# EAGLE design main_board (EAGLE 7.4.0)
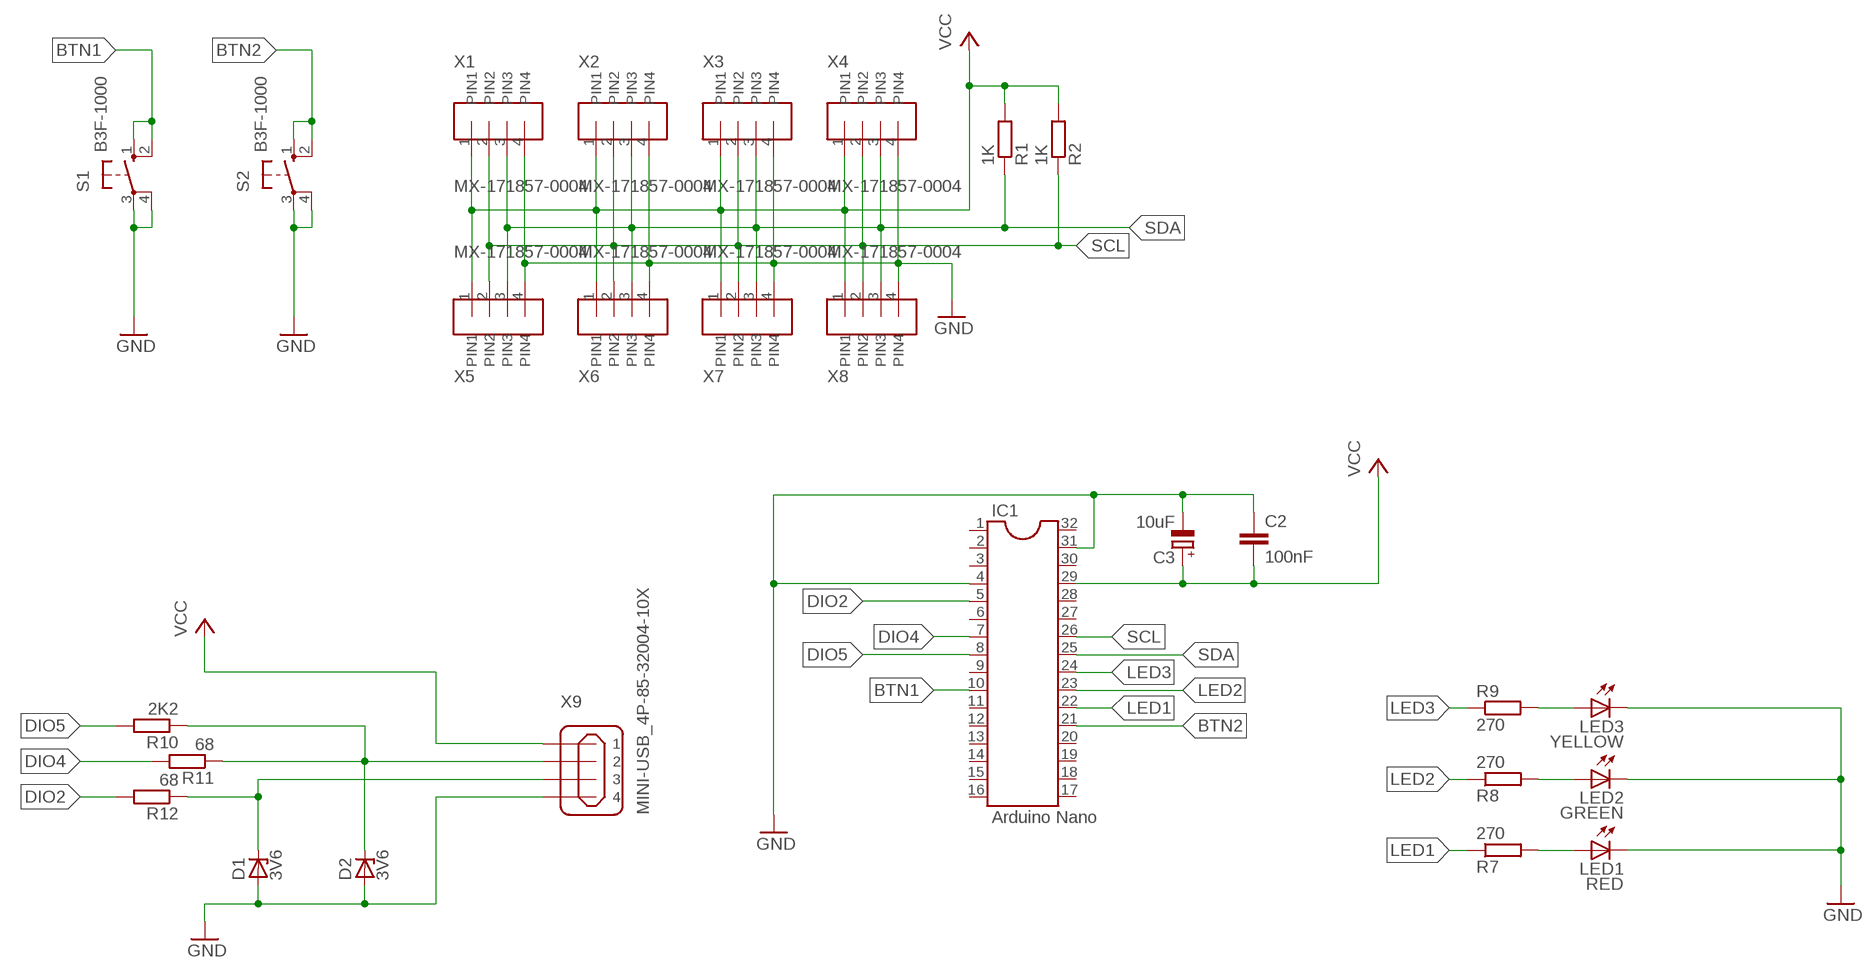
[diagram p0: schematic, sheet 1]

## Parts
C2  100nF  C-EU050-030X075  [C050-030X075]
C3  10uF  CPOL-EUE2.5-7  [E2,5-7]
D1  3V6  ZPD  [DO35Z10]
D2  3V6  ZPD  [DO35Z10]
IC1  Arduino Nano  DIL32  [DIL32]
LED1  RED  TLLR4400  [LED3MM]
LED2  GREEN  TLLR4400  [LED3MM]
LED3  YELLOW  TLLR4400  [LED3MM]
R1  1K  R-EU_0204/7  [0204/7]
R2  1K  R-EU_0204/7  [0204/7]
R7  270  R-EU_0204/7  [0204/7]
R8  270  R-EU_0204/7  [0204/7]
R9  270  R-EU_0204/7  [0204/7]
R10  2K2  R-EU_0204/7  [0204/7]
R11  68  R-EU_0204/7  [0204/7]
R12  68  R-EU_0204/7  [0204/7]
S1  B3F-1000  10-XX  [B3F-10XX]
S2  B3F-1000  10-XX  [B3F-10XX]
X1  MX-171857-0004  [MX-171857-0004]
X2  MX-171857-0004  [MX-171857-0004]
X3  MX-171857-0004  [MX-171857-0004]
X4  MX-171857-0004  [MX-171857-0004]
X5  MX-171857-0004  [MX-171857-0004]
X6  MX-171857-0004  [MX-171857-0004]
X7  MX-171857-0004  [MX-171857-0004]
X8  MX-171857-0004  [MX-171857-0004]
X9  MINI-USB_4P-85-32004-10X  [85-32004-10X]

## Nets
BTN1: IC1.10 S1.1(S) S1.2(S1)
BTN2: IC1.21 S2.1(S) S2.2(S1)
DIO2: IC1.5 R12.2
DIO4: IC1.7 R11.2
DIO5: IC1.8 R10.2
GND: C2.1 C3.- D1.A D2.A IC1.4 IC1.31 LED1.K(C) LED2.K(C) LED3.K(C) S1.3(P) S1.4(P1) S2.3(P) S2.4(P1) X1.4(PIN4) X2.4(PIN4) X3.4(PIN4) X4.4(PIN4) X5.4(PIN4) X6.4(PIN4) X7.4(PIN4) X8.4(PIN4) X9.4
LED1: IC1.22 R7.1
LED2: IC1.23 R8.1
LED3: IC1.24 R9.1
N$4: LED3.A R9.2
N$5: D1.C R12.1 X9.3
N$6: D2.C R10.1 R11.1 X9.2
N$7: LED2.A R8.2
N$8: LED1.A R7.2
SCL: IC1.26 R2.1 X1.2(PIN2) X2.2(PIN2) X3.2(PIN2) X4.2(PIN2) X5.2(PIN2) X6.2(PIN2) X7.2(PIN2) X8.2(PIN2)
SDA: IC1.25 R1.1 X1.3(PIN3) X2.3(PIN3) X3.3(PIN3) X4.3(PIN3) X5.3(PIN3) X6.3(PIN3) X7.3(PIN3) X8.3(PIN3)
VCC: C2.2 C3.+ IC1.29 R1.2 R2.2 X1.1(PIN1) X2.1(PIN1) X3.1(PIN1) X4.1(PIN1) X5.1(PIN1) X6.1(PIN1) X7.1(PIN1) X8.1(PIN1) X9.1
Unconnected: IC1.1 IC1.2 IC1.3 IC1.6 IC1.9 IC1.11 IC1.12 IC1.13 IC1.14 IC1.15 IC1.16 IC1.17 IC1.18 IC1.19 IC1.20 IC1.27 IC1.28 IC1.30 IC1.32

## Library data of the parts
C2 = resistor:C-EU: CAPACITOR, European symbol; TME_CODE: CC-100N
C3 = rcl:CPOL-EU: POLARIZED CAPACITOR, European symbol; TME_CODE: UPW2A100MED
D1 D2 = diode:ZPD: Z DIODE 500 mW; TME_CODE: ZPD3.6-DIO
IC1 = ic-package:DIL32: Dual In Line; DX_CODE: 844081877; TME_CODE: N/A
LED1 = led:TLLR4400: Low Current (2mA) LED 3 mm Tinted Diffused Package color RED Source: Data sheet <http://www.farnell.com/datasheets/391100.pdf>; MF: VISHAY SEMICONDUCTOR; OC_FARNELL: 1612437; TME_CODE: L-934ID
LED2 = led:TLLR4400: Low Current (2mA) LED 3 mm Tinted Diffused Package color RED Source: Data sheet <http://www.farnell.com/datasheets/391100.pdf>; MF: VISHAY SEMICONDUCTOR; OC_FARNELL: 1612437; TME_CODE: L-934GD
LED3 = led:TLLR4400: Low Current (2mA) LED 3 mm Tinted Diffused Package color RED Source: Data sheet <http://www.farnell.com/datasheets/391100.pdf>; MF: VISHAY SEMICONDUCTOR; OC_FARNELL: 1612437; TME_CODE: L-934YD
R1 R2 = resistor:R-EU_: RESISTOR, European symbol; TME_CODE: CF1/4W-1K
R7-R9 = resistor:R-EU_: RESISTOR, European symbol; TME_CODE: CF1/2WS-270R
R10 = resistor:R-EU_: RESISTOR, European symbol; TME_CODE: 1/4W2.2K
R11 R12 = resistor:R-EU_: RESISTOR, European symbol; TME_CODE: CF1/2WS-68R
S1 S2 = switch-omron:10-XX: OMRON SWITCH; MPN: B3F-1000; OC_FARNELL: 176432; OC_NEWARK: 36M3542; TME_CODE: B3F-1002
X1-X8 = con-molex-mx:MX-171857-0004; TME_CODE: MX-7395-04B
X9 = con-cypressindustries:MINI-USB_4P-: MINI USB 4 Pol. Source: www.cypressindustries.com; OC_FARNELL: unknown; OC_NEWARK: unknown; TME_CODE: USBB-G

## Board
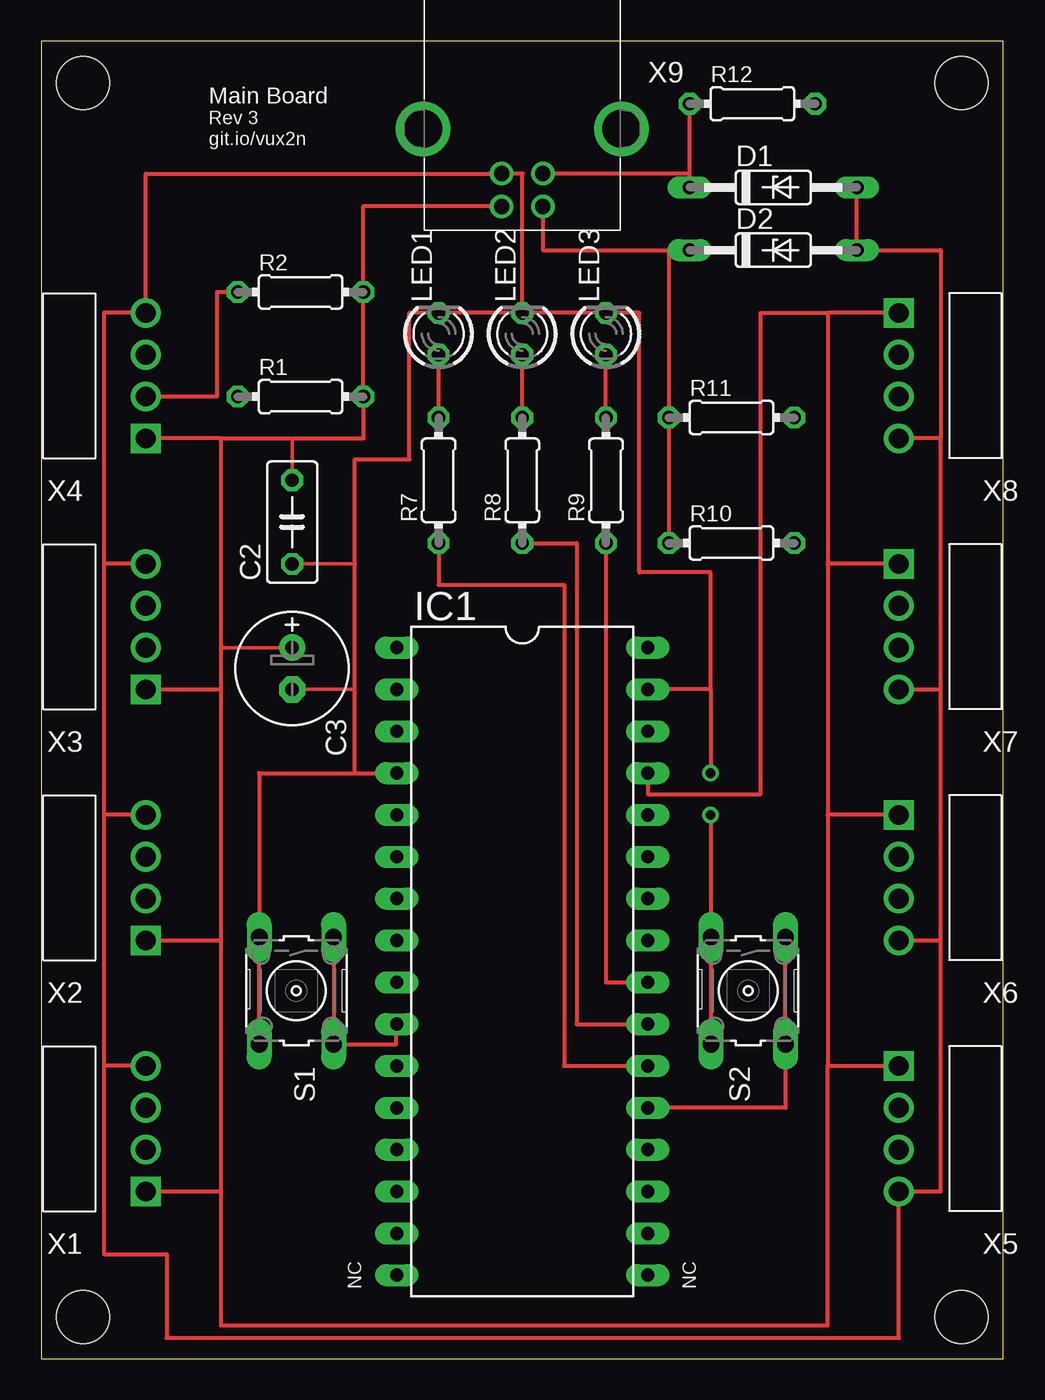
[diagram p1: board, top side]
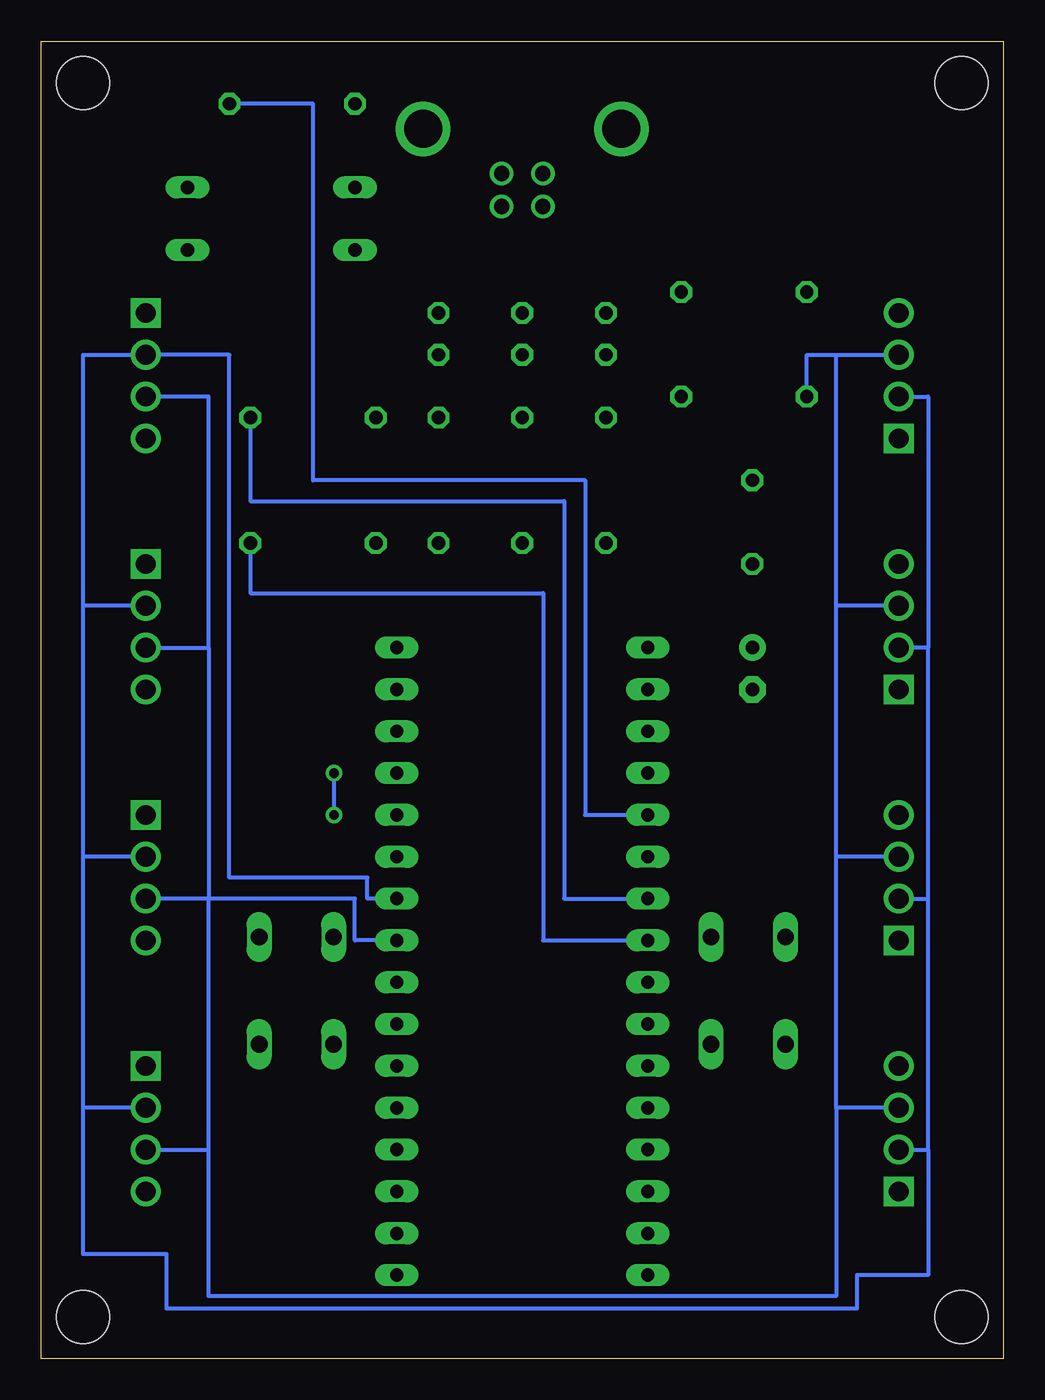
[diagram p2: board, bottom side, seen from below]

Size 58.42 x 80 mm. Coordinates in mm from the lower left corner, seen from the top.
Outline: 0,0 58.42,0 58.42,80 0,80 0,0
Copper layers (1*16): Top 0.035mm / dielectric 1.5mm / Bottom 0.035mm
Design rules "drukowane.pl": minimum track width 8mil, minimum drill 0.4mm, track to track 8mil, track to pad 8mil, pad to pad 8mil, via to via 8mil, smd to smd 8mil, copper to edge 40mil, drill to drill 8mil, minimum pad ring 10mil, minimum via ring 8mil, stop-mask expansion 4mil, vias tented up to drill 0mil, thermal gap 10mil
Holes 3.2 mm at 2.54,77.47 55.88,77.47 2.54,2.54 55.88,2.54

### Footprints (pad centres in the part's own frame; a part is rotated, then mirrored left to right if it is on the bottom)
C050-030X075 = drill 0.813 octagon: 1 -2.54,0; 2 2.54,0
E2,5-7 = drill 0.813 pad 1.6: + -1.27,0 | drill 0.813 pad 1.6 octagon: - 1.27,0
DO35Z10 = drill 0.813 long: A 5.08,0; C -5.08,0
DIL32 = drill 0.813 long: 1 -19.05,-7.62; 2 -16.51,-7.62; 3 -13.97,-7.62; 4 -11.43,-7.62; 5 -8.89,-7.62; 6 -6.35,-7.62; 7 -3.81,-7.62; 8 -1.27,-7.62; 9 1.27,-7.62; 10 3.81,-7.62; 11 6.35,-7.62; 12 8.89,-7.62; 13 11.43,-7.62; 14 13.97,-7.62; 15 16.51,-7.62; 16 19.05,-7.62; 17 19.05,7.62; 18 16.51,7.62; 19 13.97,7.62; 20 11.43,7.62; 21 8.89,7.62; 22 6.35,7.62; 23 3.81,7.62; 24 1.27,7.62; 25 -1.27,7.62; 26 -3.81,7.62; 27 -6.35,7.62; 28 -8.89,7.62; 29 -11.43,7.62; 30 -13.97,7.62; 31 -16.51,7.62; 32 -19.05,7.62
LED3MM = drill 0.813 octagon: A -1.27,0; K 1.27,0
0204/7 = drill 0.813 octagon: 1 -3.81,0; 2 3.81,0
B3F-10XX = drill 1.016 long: 1 -3.251,2.261; 2 3.251,2.261; 3 -3.251,-2.261; 4 3.251,-2.261
MX-171857-0004 = drill 1.2 square: 1 0,0 | drill 1.2: 2 2.54,0; 3 5.08,0; 4 7.62,0
85-32004-10X = drill 0.92 pad 1.27: 1 4.71,-1.25; 2 4.71,1.25; 3 2.71,1.25; 4 2.71,-1.25 | drill 2.3 pad 3: M1 0,6.02; M2 0,-6.02

### Placement (x,y rotation side)
C2  15.24,50.8 90 top
C3  15.24,41.91 270 top
D1  44.45,71.12 0 top
D2  44.45,67.31 0 top
IC1  29.21,24.13 270 top
LED1  24.13,62.23 90 top
LED2  29.21,62.23 90 top
LED3  34.29,62.23 90 top
R1  15.75,58.42 0 top
R2  15.75,64.77 0 top
R7  24.13,53.34 90 top
R8  29.21,53.34 90 top
R9  34.29,53.34 90 top
R10  41.91,49.53 0 top
R11  41.91,57.15 0 top
R12  43.18,76.2 0 top
S1  15.49,22.35 270 top
S2  42.93,22.35 270 top
X1  6.35,10.16 90 top
X2  6.35,25.4 90 top
X3  6.35,40.64 90 top
X4  6.35,55.88 90 top
X5  52.07,17.78 270 top
X6  52.07,33.02 270 top
X7  52.07,48.26 270 top
X8  52.07,63.5 270 top
X9  29.21,74.68 270 top

### Tracks (layer width: path | path; a pad name or v marks a point on that pad's centre or on a via)
BTN1
  Top 0.254: IC1.10 21.55,20.32 21.55,19.1 S1.2 S1.1
BTN2
  Top 0.254: IC1.21 45.19,15.24 S2.2 S2.1
DIO2
  Bottom 0.254: R12.2 41.91,76.2 41.91,53.34 25.4,53.34 25.4,33.02 IC1.5
DIO4
  Bottom 0.254: R11.2 45.72,52.07 26.67,52.07 26.67,27.94 IC1.7
DIO5
  Bottom 0.254: R10.2 45.72,46.48 27.94,46.48 27.94,25.4 IC1.8
GND  (via drill 0.6)
  Top 0.203: C2.1 19.05,48.26 | C3.- 19.05,40.64 19.05,40.39
  Top 0.254: 54.61,25.4 54.61,10.16 X5.4 52.07,1.27 7.62,1.27 7.62,6.35 3.81,6.35 3.81,17.78 | 54.61,25.4 54.61,40.64 | 54.61,40.64 54.61,55.88 | 54.61,55.88 X8.4 | 3.81,48.26 3.81,63.5 X4.4 6.35,71.97 X9.4 29.21,71.97 LED2.K | 3.81,48.26 3.81,33.02 | 3.81,33.02 3.81,17.78 | X1.4 3.81,17.78 | D1.A D2.A 54.61,67.31 54.61,55.88 | X3.4 3.81,48.26 | X6.4 54.61,25.4 | X7.4 54.61,40.64 | X2.4 3.81,33.02 | 19.05,35.56 19.05,40.39 19.05,48.26 19.05,54.61 22.35,54.61 22.35,63.5 LED1.K LED2.K | v40.64,33.02 40.66,33.02 S2.3 S2.4 | LED2.K LED3.K 36.32,63.5 36.32,47.75 40.64,47.75 40.64,40.64 | 19.05,35.56 IC1.4 | 40.64,40.64 IC1.31 | 40.64,40.64 v40.64,35.56 | 19.05,35.56 13.23,35.56 S1.3 S1.4
  Bottom 0.254: v40.64,33.02 v40.64,35.56
LED1
  Top 0.254: R7.1 24.13,46.99 31.75,46.99 31.75,17.78 IC1.22
LED2
  Top 0.254: R8.1 32.51,49.53 32.51,20.32 IC1.23
LED3
  Top 0.254: R9.1 34.29,22.86 IC1.24
N$4
  Top 0.254: R9.2 LED3.A
N$5
  Top 0.254: R12.1 D1.C 39.37,71.97 X9.3
N$6
  Top 0.254: X9.2 30.46,67.31 D2.C 38.1,67.31 R11.1 R10.1
N$7
  Top 0.254: R8.2 LED2.A
N$8
  Top 0.254: R7.2 LED1.A
SCL
  Top 0.254: R2.1 10.67,64.77 10.67,58.42 X4.2
  Bottom 0.254: X6.2 55.88,30.48 | 55.88,30.48 55.88,45.72 | 55.88,45.72 55.88,60.96 X8.2 46.99,60.96 46.99,29.21 38.61,29.21 38.61,27.94 IC1.26 | X5.2 55.88,15.24 | 55.88,15.24 55.88,30.48 | 4.57,12.7 4.57,5.08 8.89,5.08 8.89,3.05 50.8,3.05 50.8,6.35 55.88,6.35 55.88,15.24 | X1.2 4.57,12.7 | 4.57,12.7 4.57,27.94 | 4.57,27.94 4.57,43.18 | X2.2 4.57,27.94 | X4.2 4.57,58.42 4.57,43.18 | 4.57,43.18 X3.2 | X7.2 55.88,45.72
SDA
  Bottom 0.254: R1.1 11.94,60.96 10.16,60.96 | 10.16,60.96 X4.3 | 48.26,27.94 39.37,27.94 39.37,25.4 IC1.25 | 48.26,27.94 X6.3 | X5.3 48.26,12.7 | 48.26,12.7 48.26,27.94 | 10.16,15.24 10.16,3.81 48.26,3.81 48.26,12.7 | X1.3 10.16,15.24 | 10.16,15.24 10.16,30.48 | 10.16,30.48 10.16,45.72 | 10.16,45.72 10.16,60.96 | X3.3 10.16,45.72 | X2.3 10.16,30.48 | 48.26,43.18 48.26,27.94 | X7.3 48.26,43.18 | 48.26,43.18 48.26,58.42 X8.3
VCC
  Top 0.203: C2.2 15.24,55.88 | C3.+ 10.92,43.18
  Top 0.254: 10.92,10.16 10.92,2.03 47.75,2.03 47.75,17.78 | 10.92,10.16 10.92,25.4 | 10.92,25.4 10.92,40.64 | 10.92,40.64 10.92,43.18 10.92,55.88 | 10.92,55.88 X4.1 | X8.1 47.75,63.5 | 47.75,63.5 47.75,48.26 | 47.75,48.26 47.75,33.02 | 47.75,33.02 47.75,17.78 | 47.75,17.78 X5.1 | X9.1 19.56,69.97 R2.2 R1.2 19.56,55.88 15.24,55.88 10.92,55.88 | X3.1 10.92,40.64 | X7.1 47.75,48.26 | X6.1 47.75,33.02 | X1.1 10.92,10.16 | X2.1 10.92,25.4 | IC1.29 36.83,34.29 43.69,34.29 43.69,63.5 47.75,63.5

### Text on the board
tPlace: Main Board | Rev 3 | git.io/vux2n | NC | NC